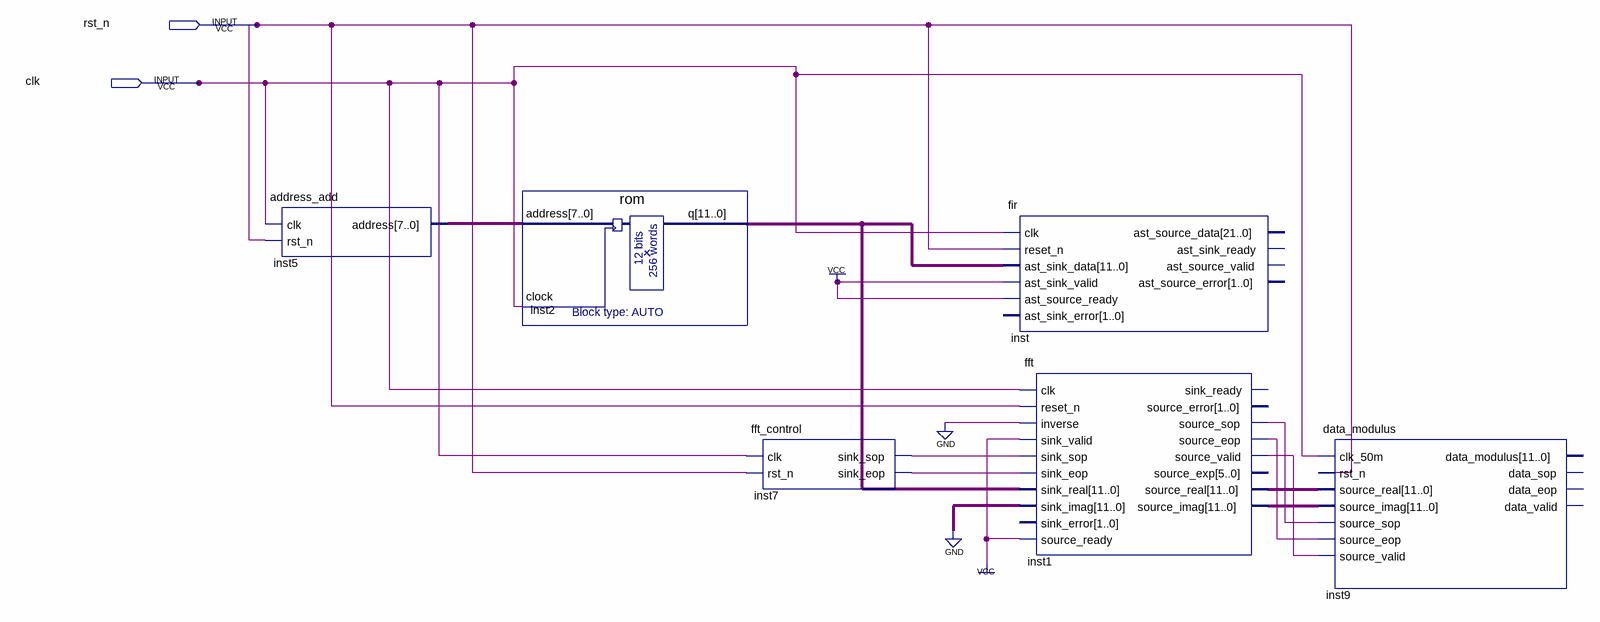
[diagram p0: schematic sheet]
// Quartus schematic fir_test.bdf as structural Verilog: 6 symbols, 2 pins
module fir_test (
  input  rst_n,
  input  clk
);

  wire inst1_source_eop, inst1_source_sop, inst1_source_valid, inst7_sink_eop, inst7_sink_sop;
  wire [7:0] inst5_address;
  wire [11:0] inst1_source_imag, inst1_source_real, inst2_q;

  address_add inst5 (.clk(clk), .rst_n(rst_n), .address(inst5_address));
  rom inst2 (.address(inst5_address), .clock(clk), .q(inst2_q));
  fft_control inst7 (.clk(clk), .rst_n(rst_n), .sink_sop(inst7_sink_sop), .sink_eop(inst7_sink_eop));
  fir inst (
    .clk(clk), .reset_n(rst_n), .ast_sink_data(inst2_q), .ast_sink_valid(1'b1), .ast_source_ready(1'b1));  // open: ast_sink_error, ast_source_data, ast_sink_ready, ast_source_valid, ast_source_error
  fft inst1 (
    .clk(clk), .reset_n(rst_n), .inverse(1'b0), .sink_valid(1'b1), .sink_sop(inst7_sink_sop),
    .sink_eop(inst7_sink_eop), .sink_real(inst2_q), .sink_imag({12{1'b0}}), .source_ready(1'b1),
    .source_sop(inst1_source_sop), .source_eop(inst1_source_eop), .source_valid(inst1_source_valid),
    .source_real(inst1_source_real), .source_imag(inst1_source_imag));  // open: sink_error, sink_ready, source_error, source_exp
  data_modulus inst9 (
    .clk_50m(clk), .rst_n(rst_n), .source_real(inst1_source_real), .source_imag(inst1_source_imag),
    .source_sop(inst1_source_sop), .source_eop(inst1_source_eop), .source_valid(inst1_source_valid));  // open: data_modulus, data_sop, data_eop, data_valid
endmodule
